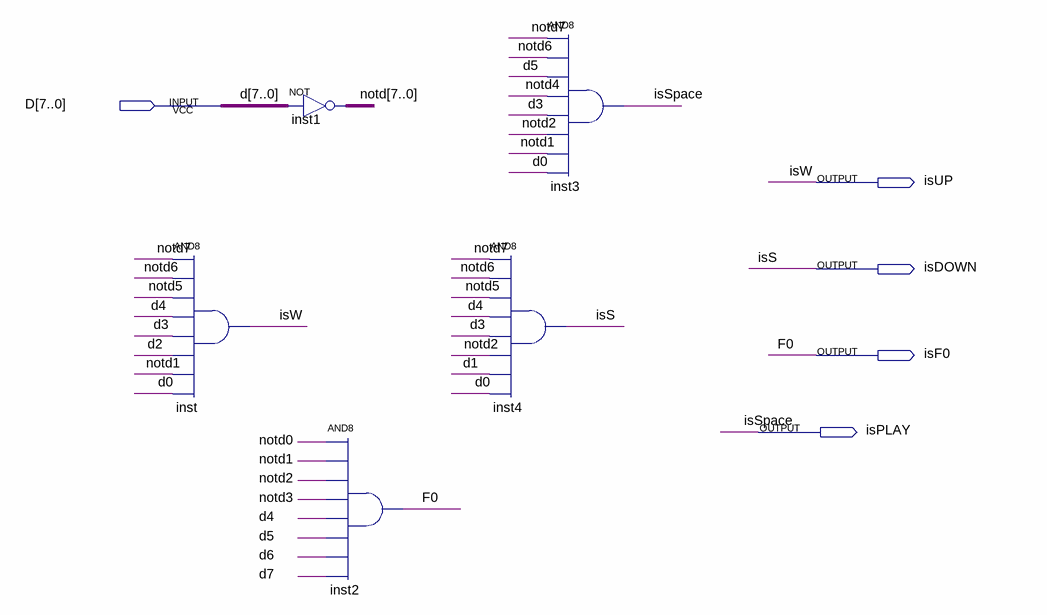
[diagram p0: schematic sheet]
// Quartus schematic KeyDetector.bdf as structural Verilog: 5 symbols, 5 pins
module KeyDetector (
  input  [7:0] D,
  output isUP,
  output isDOWN,
  output isF0,
  output isPLAY
);

  wire [7:0] notd;

  and inst (isUP, notd[7], notd[6], notd[5], D[4], D[3], D[2], notd[1], D[0]);
  assign notd = ~D;  // NOT inst1, 8 bits wide
  and inst2 (isF0, notd[0], notd[1], notd[2], notd[3], D[4], D[5], D[6], D[7]);
  and inst3 (isPLAY, notd[7], notd[6], D[5], notd[4], D[3], notd[2], notd[1], D[0]);
  and inst4 (isDOWN, notd[7], notd[6], notd[5], D[4], D[3], notd[2], D[1], D[0]);

  // Other names for the same wires on the sheet: F0 = isF0; isS = isDOWN; isSpace = isPLAY; isW = isUP
endmodule
